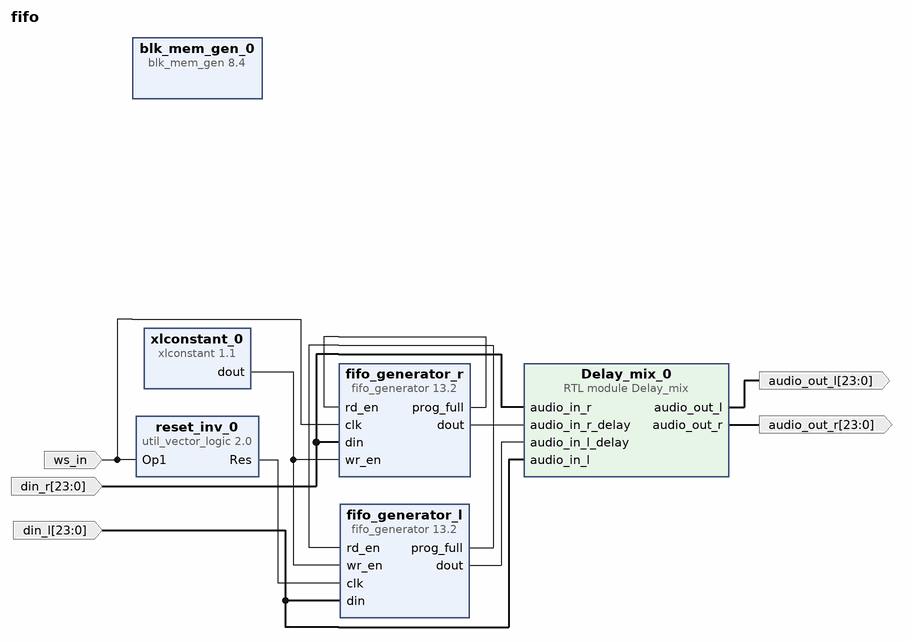
[diagram p0: block diagram of the top level]
# Vivado block design fifo, xc7a100tcsg324-1, Vivado 2022.1
create_bd_design fifo

create_bd_port -dir I -from 23 -to 0 din_l
create_bd_port -dir I -from 23 -to 0 din_r
create_bd_port -dir O -from 23 -to 0 audio_out_l
create_bd_port -dir O -from 23 -to 0 audio_out_r
create_bd_port -dir I -type clk ws_in
set_property -dict {CONFIG.FREQ_HZ 11490000 CONFIG.PHASE 0.0} [get_bd_ports ws_in]

create_bd_cell -type ip -vlnv xilinx.com:ip:fifo_generator:13.2 fifo_generator_l
set_property -dict [list \
  CONFIG.Full_Threshold_Assert_Value 44000 \
  CONFIG.Input_Data_Width 24 \
  CONFIG.Input_Depth 65536 \
  CONFIG.Output_Data_Width 24 \
  CONFIG.Programmable_Full_Type Single_Programmable_Full_Threshold_Constant \
  CONFIG.Reset_Pin false \
] [get_bd_cells fifo_generator_l]
create_bd_cell -type ip -vlnv xilinx.com:ip:xlconstant:1.1 xlconstant_0
create_bd_cell -type ip -vlnv xilinx.com:ip:util_vector_logic:2.0 reset_inv_0
set_property -dict {CONFIG.C_OPERATION not CONFIG.C_SIZE 1} [get_bd_cells reset_inv_0]
create_bd_cell -type ip -vlnv xilinx.com:ip:fifo_generator:13.2 fifo_generator_r
set_property -dict [list \
  CONFIG.Full_Threshold_Assert_Value 22000 \
  CONFIG.Input_Data_Width 24 \
  CONFIG.Input_Depth 65536 \
  CONFIG.Output_Data_Width 24 \
  CONFIG.Programmable_Full_Type Single_Programmable_Full_Threshold_Constant \
  CONFIG.Reset_Pin false \
] [get_bd_cells fifo_generator_r]
create_bd_cell -type ip -vlnv xilinx.com:ip:blk_mem_gen:8.4 blk_mem_gen_0
set_property -dict [list \
  CONFIG.Additional_Inputs_for_Power_Estimation false \
  CONFIG.Enable_32bit_Address false \
  CONFIG.Enable_A Always_Enabled \
  CONFIG.Memory_Type Single_Port_RAM \
  CONFIG.Operating_Mode_A NO_CHANGE \
  CONFIG.Port_B_Clock 0 \
  CONFIG.Port_B_Enable_Rate 0 \
  CONFIG.Read_Width_A 24 \
  CONFIG.Register_PortA_Output_of_Memory_Primitives true \
  CONFIG.Use_Byte_Write_Enable false \
  CONFIG.Use_RSTA_Pin false \
  CONFIG.Write_Depth_A 44000 \
  CONFIG.Write_Width_A 24 \
  CONFIG.use_bram_block Stand_Alone \
] [get_bd_cells blk_mem_gen_0]
create_bd_cell -type module -reference Delay_mix Delay_mix_0

# ---- connections ----

connect_bd_net [get_bd_pins Delay_mix_0/audio_out_l] [get_bd_ports audio_out_l]
connect_bd_net [get_bd_pins Delay_mix_0/audio_out_r] [get_bd_ports audio_out_r]
connect_bd_net -net Op1_0_1 [get_bd_ports ws_in] [get_bd_pins reset_inv_0/Op1] [get_bd_pins fifo_generator_r/clk]
connect_bd_net [get_bd_ports din_l] [get_bd_pins fifo_generator_l/din] [get_bd_pins Delay_mix_0/audio_in_l]
connect_bd_net [get_bd_ports din_r] [get_bd_pins fifo_generator_r/din] [get_bd_pins Delay_mix_0/audio_in_r]
connect_bd_net -net fifo_generator_0_prog_full [get_bd_pins fifo_generator_l/prog_full] [get_bd_pins fifo_generator_l/rd_en]
connect_bd_net -net fifo_generator_1_prog_full [get_bd_pins fifo_generator_r/prog_full] [get_bd_pins fifo_generator_r/rd_en]
connect_bd_net [get_bd_pins fifo_generator_l/dout] [get_bd_pins Delay_mix_0/audio_in_l_delay]
connect_bd_net [get_bd_pins fifo_generator_r/dout] [get_bd_pins Delay_mix_0/audio_in_r_delay]
connect_bd_net [get_bd_pins reset_inv_0/Res] [get_bd_pins fifo_generator_l/clk]
connect_bd_net [get_bd_pins xlconstant_0/dout] [get_bd_pins fifo_generator_l/wr_en] [get_bd_pins fifo_generator_r/wr_en]

validate_bd_design
save_bd_design
